# Altium project PCB_Project.PrjPcb
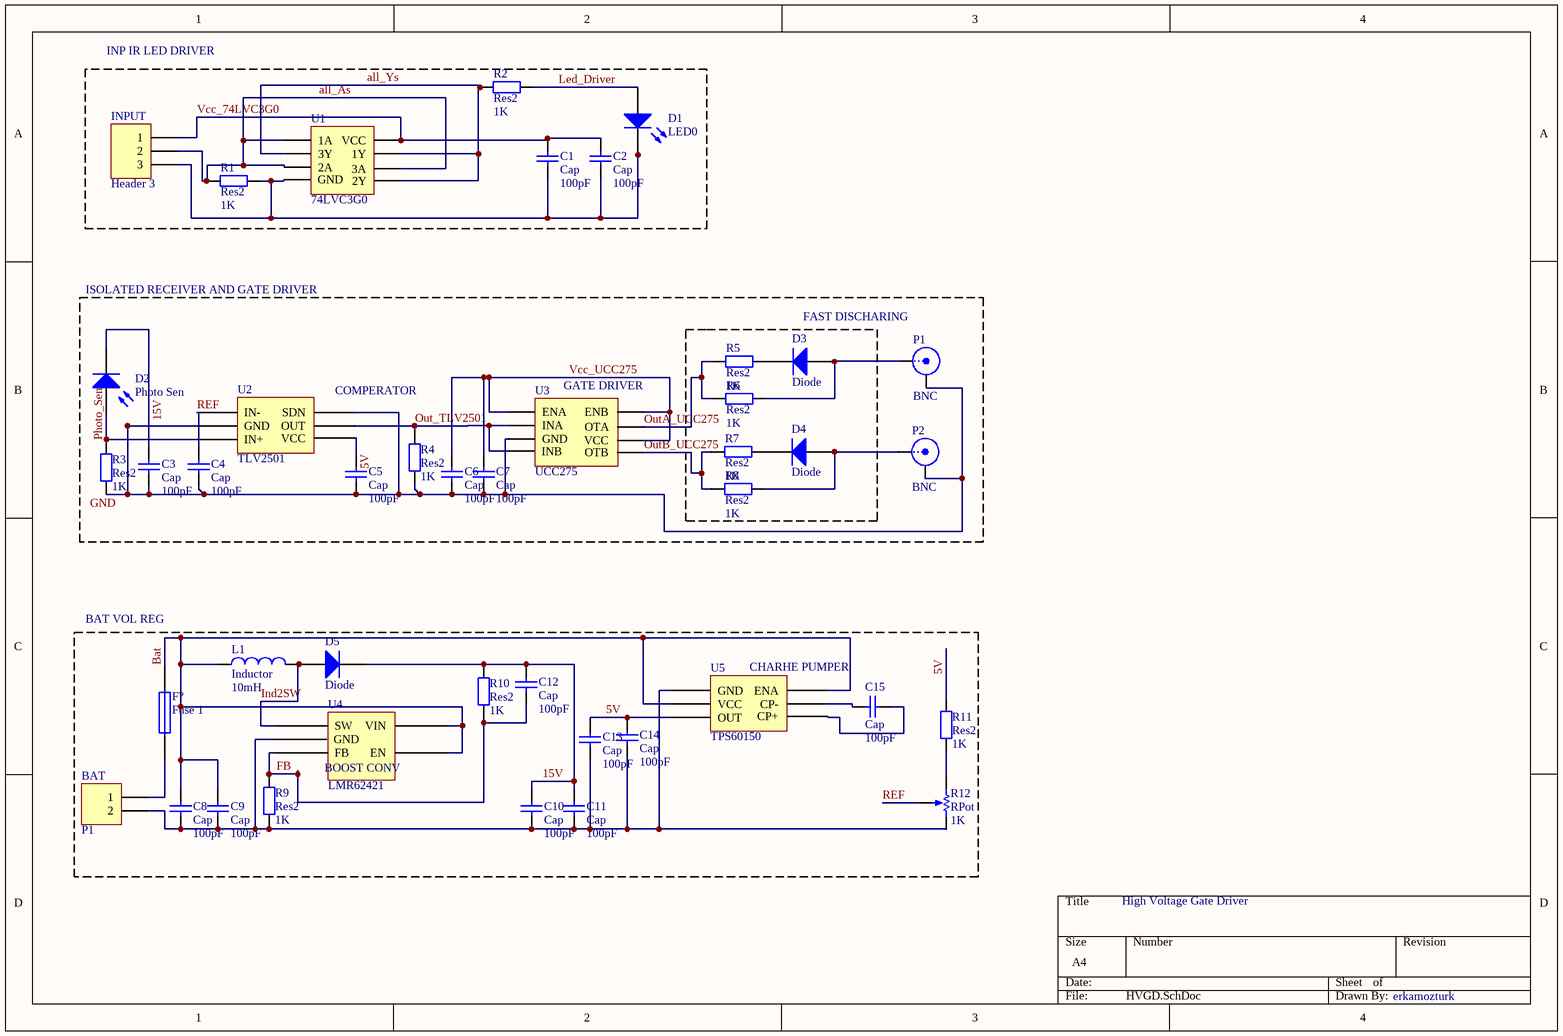
[diagram p0: HVGD.SchDoc]
1 sheet, 43 parts. Net scope: global (net labels, ports and power ports of the same name join across sheets).
Board file: Video.PcbDoc

## Sheet HVGD.SchDoc: High Voltage Gate Drıver by erkamozturk
size A4; DrawnBy: erkamozturk

### Parts
BAT  P1  [HDR1X2]
C1  Cap  value 100pF  [0805-fw]
C2  Cap  value 100pF  [0402]
C3  Cap  value 100pF  [0402]
C4  Cap  value 100pF  [0402]
C5  Cap  value 100pF  [0402]
C6  Cap  value 100pF  [0402]
C7  Cap  value 100pF  [0402]
C8  Cap  value 100pF  [0805-fw]
C9  Cap  value 100pF  [0805-fw]
C10  Cap  value 100pF  [0805-fw]
C11  Cap  value 100pF  [0805-fw]
C12  Cap  value 100pF  [0402]
C13  Cap  value 100pF  [0805-fw]
C14  Cap  value 100pF  [0402]
C15  Cap  value 100pF  [0402]
D1  LED0  [T1]
D2  Photo Sen  [T1]
D3  Diode  [0402]
D4  Diode  [0402]
D5  Diode  [0402]
F?  Fuse 1  [0402]
INPUT  Header 3  [HDR1X3]
L1  Inductor  value 10mH  [0805-fw]
P1  BNC  [UFL]
P2  BNC  [UFL]
R1  Res2  value 1K  [0402]
R2  Res2  value 1K  [0402]
R3  Res2  value 1K  [0402]
R4  Res2  value 1K  [0402]
R5  Res2  value 1K  [0805-fw]
R6  Res2  value 1K  [0805-fw]
R7  Res2  value 1K  [0805-fw]
R8  Res2  value 1K  [0805-fw]
R9  Res2  value 1K  [0402]
R10  Res2  value 1K  [0402]
R11  Res2  value 1K  [0402]
R12  RPot  value 1K  [PVG5A]
U1  74LVC3G0  [DUC8]
U2  TLV2501  [SOT236]
U3  UCC275  [DFN8]
U4  LMR62421  [SOT235]
U5  TPS60150  [DFN6]

### Blocks framed on the sheet
INP IR LED DRIVER: C1 C2 D1 INPUT R1 R2 U1
FAST DISCHARING: D3 D4 R5-R8

### Nets
5V: C5.2 C13.2 C14.2 R11.2 U2.4(VCC) U5.3(OUT)
15V: C3.2 C10.2 C11.2 C12.2 D2.2(K) D5.2(K) R10.1
all_As: INPUT.2 R1.2 U1.1(1A) U1.3(2A) U1.6(3A)
all_Ys: R2.2 U1.2(3Y) U1.5(2Y) U1.7(1Y)
Bat: C8.2 C9.2 F?.2 L1.1 U4.4(EN) U4.5(VIN) U5.2(VCC) U5.6(ENA)
FB: C12.1 R9.1 R10.2 U4.3(FB)
GND: C3.1 C4.1 C5.1 C6.1 C7.1 P1.2(Y) P2.2(Y) R3.2 R4.2 U2.2(GND) U2.6(SDN) U3.3(GND)
Ind2SW: D5.1(A) L1.2 U4.1(SW)
Led_Driver: D1.1(A) R2.1
Out_TLV2501: R4.1 U2.5(OUT) U3.2(INA) U3.4(INB)
OutA_UCC275: R5.1 R6.1 U3.7(OTA)
OutB_UCC275: R7.1 R8.1 U3.5(OTB)
Photo_Sen: D2.1(A) R3.1 U2.3(IN+)
REF: C4.2 R12.3(TAP) U2.1(IN-)
Vcc_74LVC3G0: C1.2 C2.2 INPUT.1 U1.8(VCC)
Vcc_UCC275: C6.2 C7.2 U3.1(ENA) U3.6(VCC) U3.8(ENB)
NetBAT_1: BAT.1 F?.1
NetBAT_2: BAT.2 C8.1 C9.1 C10.1 C11.1 C13.1 C14.1 R9.2 R12.2(BOT) U4.2(GND) U5.1(GND)
NetC1_1: C1.1 C2.1 D1.2(K) INPUT.3 R1.1 U1.4(GND)
NetC15_1: C15.1 U5.4(CP+)
NetC15_2: C15.2 U5.5(CP-)
NetD3_1: D3.1(A) P1.1(X) R6.2
NetD3_2: D3.2(K) R5.2
NetD4_1: D4.1(A) P2.1(X) R8.2
NetD4_2: D4.2(K) R7.2
NetR11_1: R11.1 R12.1(TOP)

### Notes on the sheet
- ISOLATED RECEIVER AND GATE DRIVER
- (near U2) COMPERATOR
- (near U3) GATE DRIVER
- BAT VOL REG
- (near U5) CHARHE PUMPER
- (near U4) BOOST CONV
- High Voltage Gate Driver
- erkamozturk

### Library data of the parts
BAT = Header 2: Header, 2-Pin; LatestRevisionDate: 17-Jul-2002; LatestRevisionNote: Re-released for DXP Platform.; Publisher: Altium Limited
C1-C15 = Cap: Capacitor; Published: 8-Jun-2000; LatestRevisionDate: 17-Jul-2002; LatestRevisionNote: Re-released for DXP Platform.; PackageReference: RAD-0.3; Publisher: Altium Limited; PackageDescription: Radial Cap, Thru-Hole; 2 Leads; 0.3 in Pin Spacing
D1 = LED0: Typical INFRARED GaAs LED; Published: 8-Jun-2000; LatestRevisionDate: 08-Jul-2005; LatestRevisionNote: Mech Layer 1 removed.; PackageReference: LED-0; Publisher: Altium Limited; PackageDescription: LED; 2 Leads
D2 = Photo Sen: Photosensitive Diode; Published: 24-Mar-1999; LatestRevisionDate: 17-Jul-2002; LatestRevisionNote: Re-released for DXP Platform.; PackageReference: PIN2; Publisher: Altium Limited
D3-D5 = Diode: Default Diode; Published: 8-Jun-2000; LatestRevisionDate: 17-Jul-2002; LatestRevisionNote: Re-released for DXP Platform.; PackageVersion: Sep-1996; PackageReference: SMC; Publisher: Altium Limited; PackageDescription: DO-214-AB/SMC; 2 C-Bend Leads; Body 7.9 x 5.9 mm, inc. leads (LxW); Code_JEDEC: DO-214-AB
F? = Fuse 1: Fuse; Published: 8-Jun-2000; LatestRevisionDate: 17-Jul-2002; LatestRevisionNote: Re-released for DXP Platform.; PackageReference: PIN-W2/E2.8; Publisher: Altium Limited; PackageDescription: Thru-Hole; 2 Leads
INPUT = Header 3: Header, 3-Pin; LatestRevisionDate: 17-Jul-2002; LatestRevisionNote: Re-released for DXP Platform.; Publisher: Altium Limited
L1 = Inductor: Code_IEC: 1005; Published: 8-Jun-2000; LatestRevisionDate: 29-May-2009; LatestRevisionNote: IPC-7351 Footprint Added.; PackageReference: 0402-A; Publisher: Altium Limited; PackageDescription: Chip Inductor; Code_JEITA: 0402
P1 P2 = BNC: BNC Elbow Connector; LatestRevisionDate: 17-Jul-2002; LatestRevisionNote: Re-released for DXP Platform.; Publisher: Altium Limited
R1-R11 = Res2: Resistor; Published: 8-Jun-2000; LatestRevisionDate: 17-Jul-2002; LatestRevisionNote: Re-released for DXP Platform.; PackageReference: AXIAL-0.4; Publisher: Altium Limited; PackageDescription: Axial Device, Thru-Hole; 2 Leads; 0.4 in Pin Spacing
R12 = RPot: Potentiometer; Sim Note: Enter the Resistance value and the set point into parameter fields.; Set Position: 0.5; Published: 8-Jun-2000; LatestRevisionDate: 17-Jul-2002; LatestRevisionNote: Re-released for DXP Platform.; PackageReference: VR5; Publisher: Altium Limited; PackageDescription: Variable Resistor, Thru-Hole; 3 Leads